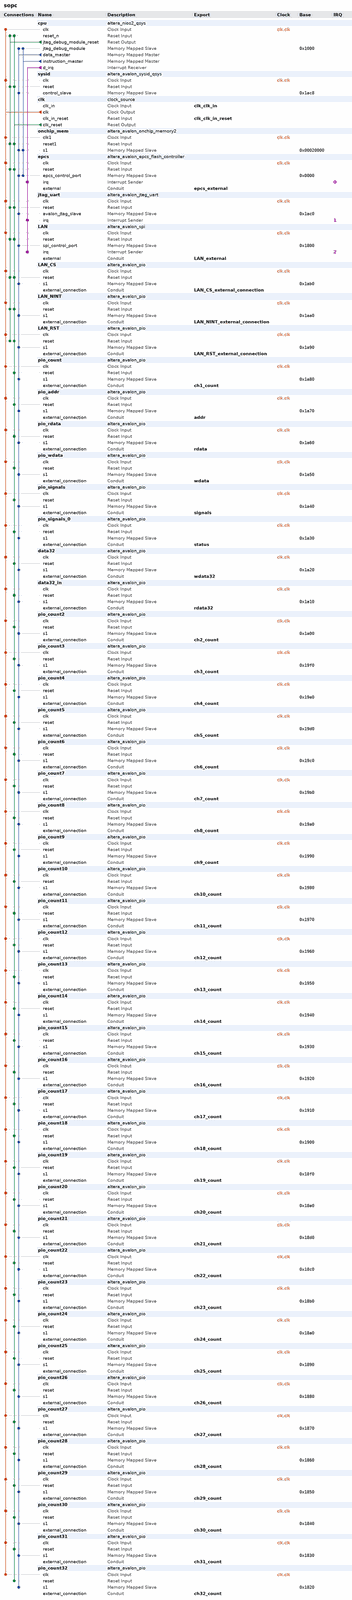
[diagram p0: system contents, whole]
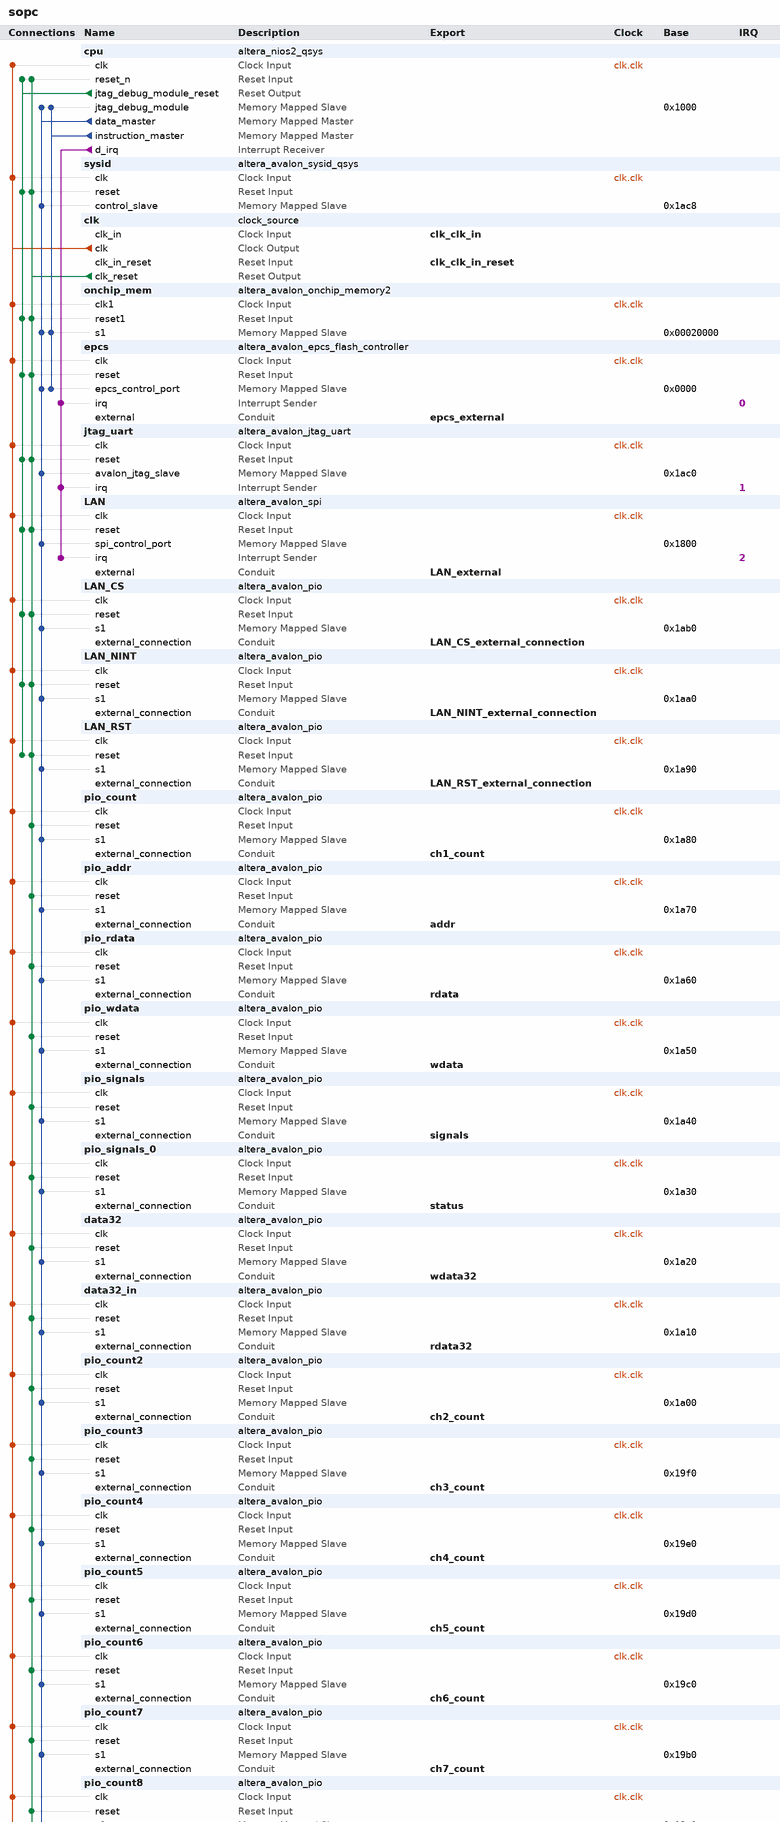
[diagram p1: system contents, upper part]
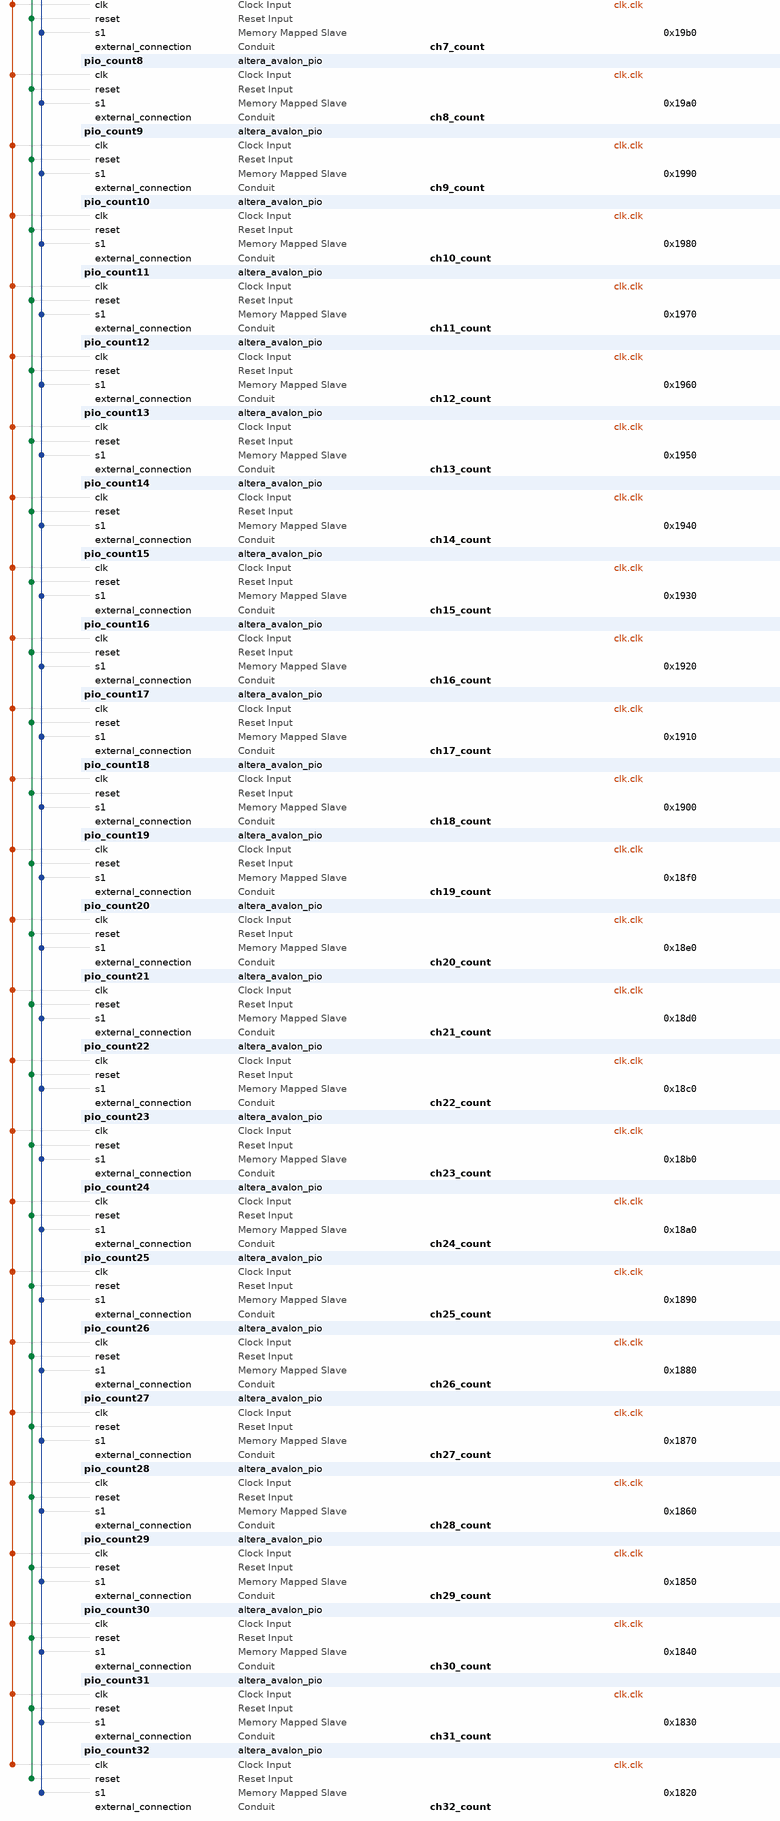
[diagram p2: system contents, lower part]
# Platform Designer (Qsys) system sopc, Cyclone IV GX Unknown
# Parameters at their usual value, and those the tool derives, are not listed.
package require -exact qsys 13.1
create_system sopc
set_project_property DEVICE_FAMILY {Cyclone IV GX}
set_project_property DEVICE Unknown

add_instance cpu altera_nios2_qsys 13.1
set_instance_parameter_value cpu manuallyAssignCpuID false
set_instance_parameter_value cpu resetSlave onchip_mem.s1
set_instance_parameter_value cpu exceptionSlave onchip_mem.s1
set_instance_parameter_value cpu breakSlave cpu.jtag_debug_module
set_instance_parameter_value cpu impl Tiny
set_instance_parameter_value cpu icache_size 2048
set_instance_parameter_value cpu dcache_size 0

add_instance sysid altera_avalon_sysid_qsys 13.1
set_instance_parameter_value sysid id 0

add_instance clk clock_source 13.1
set_instance_parameter_value clk clockFrequency 50000000

add_instance onchip_mem altera_avalon_onchip_memory2 13.1
set_instance_parameter_value onchip_mem dataWidth 32
set_instance_parameter_value onchip_mem dualPort false
set_instance_parameter_value onchip_mem initMemContent true
set_instance_parameter_value onchip_mem initializationFileName onchip_mem
set_instance_parameter_value onchip_mem memorySize 43000

add_instance epcs altera_avalon_epcs_flash_controller 13.1

add_instance jtag_uart altera_avalon_jtag_uart 13.1
set_instance_parameter_value jtag_uart simInteractiveOptions INTERACTIVE_ASCII_OUTPUT

add_instance LAN altera_avalon_spi 13.1
set_instance_parameter_value LAN clockPolarity 0
set_instance_parameter_value LAN dataWidth 8
set_instance_parameter_value LAN masterSPI true
set_instance_parameter_value LAN numberOfSlaves 1
set_instance_parameter_value LAN targetClockRate 500000

add_instance LAN_CS altera_avalon_pio 13.1
set_instance_parameter_value LAN_CS direction Output
set_instance_parameter_value LAN_CS width 1

add_instance LAN_NINT altera_avalon_pio 13.1
set_instance_parameter_value LAN_NINT direction Input
set_instance_parameter_value LAN_NINT width 1

add_instance LAN_RST altera_avalon_pio 13.1
set_instance_parameter_value LAN_RST direction Output
set_instance_parameter_value LAN_RST width 1

add_instance pio_count altera_avalon_pio 13.1
set_instance_parameter_value pio_count direction Input
set_instance_parameter_value pio_count width 32

add_instance pio_addr altera_avalon_pio 13.1
set_instance_parameter_value pio_addr direction Output
set_instance_parameter_value pio_addr width 8

add_instance pio_rdata altera_avalon_pio 13.1
set_instance_parameter_value pio_rdata direction Input
set_instance_parameter_value pio_rdata width 8

add_instance pio_wdata altera_avalon_pio 13.1
set_instance_parameter_value pio_wdata direction Output
set_instance_parameter_value pio_wdata width 8

add_instance pio_signals altera_avalon_pio 13.1
set_instance_parameter_value pio_signals direction Output
set_instance_parameter_value pio_signals width 8

add_instance pio_signals_0 altera_avalon_pio 13.1
set_instance_parameter_value pio_signals_0 direction Input
set_instance_parameter_value pio_signals_0 width 8

add_instance data32 altera_avalon_pio 13.1
set_instance_parameter_value data32 direction Output
set_instance_parameter_value data32 width 32

add_instance data32_in altera_avalon_pio 13.1
set_instance_parameter_value data32_in direction Output
set_instance_parameter_value data32_in width 32

add_instance pio_count2 altera_avalon_pio 13.1
set_instance_parameter_value pio_count2 direction Input
set_instance_parameter_value pio_count2 width 32

add_instance pio_count3 altera_avalon_pio 13.1
set_instance_parameter_value pio_count3 direction Input
set_instance_parameter_value pio_count3 width 32

add_instance pio_count4 altera_avalon_pio 13.1
set_instance_parameter_value pio_count4 direction Input
set_instance_parameter_value pio_count4 width 32

add_instance pio_count5 altera_avalon_pio 13.1
set_instance_parameter_value pio_count5 direction Input
set_instance_parameter_value pio_count5 width 32

add_instance pio_count6 altera_avalon_pio 13.1
set_instance_parameter_value pio_count6 direction Input
set_instance_parameter_value pio_count6 width 32

add_instance pio_count7 altera_avalon_pio 13.1
set_instance_parameter_value pio_count7 direction Input
set_instance_parameter_value pio_count7 width 32

add_instance pio_count8 altera_avalon_pio 13.1
set_instance_parameter_value pio_count8 direction Input
set_instance_parameter_value pio_count8 width 32

add_instance pio_count9 altera_avalon_pio 13.1
set_instance_parameter_value pio_count9 direction Input
set_instance_parameter_value pio_count9 width 32

add_instance pio_count10 altera_avalon_pio 13.1
set_instance_parameter_value pio_count10 direction Input
set_instance_parameter_value pio_count10 width 32

add_instance pio_count11 altera_avalon_pio 13.1
set_instance_parameter_value pio_count11 direction Input
set_instance_parameter_value pio_count11 width 32

add_instance pio_count12 altera_avalon_pio 13.1
set_instance_parameter_value pio_count12 direction Input
set_instance_parameter_value pio_count12 width 32

add_instance pio_count13 altera_avalon_pio 13.1
set_instance_parameter_value pio_count13 direction Input
set_instance_parameter_value pio_count13 width 32

add_instance pio_count14 altera_avalon_pio 13.1
set_instance_parameter_value pio_count14 direction Input
set_instance_parameter_value pio_count14 width 32

add_instance pio_count15 altera_avalon_pio 13.1
set_instance_parameter_value pio_count15 direction Input
set_instance_parameter_value pio_count15 width 32

add_instance pio_count16 altera_avalon_pio 13.1
set_instance_parameter_value pio_count16 direction Input
set_instance_parameter_value pio_count16 width 32

add_instance pio_count17 altera_avalon_pio 13.1
set_instance_parameter_value pio_count17 direction Input
set_instance_parameter_value pio_count17 width 32

add_instance pio_count18 altera_avalon_pio 13.1
set_instance_parameter_value pio_count18 direction Input
set_instance_parameter_value pio_count18 width 32

add_instance pio_count19 altera_avalon_pio 13.1
set_instance_parameter_value pio_count19 direction Input
set_instance_parameter_value pio_count19 width 32

add_instance pio_count20 altera_avalon_pio 13.1
set_instance_parameter_value pio_count20 direction Input
set_instance_parameter_value pio_count20 width 32

add_instance pio_count21 altera_avalon_pio 13.1
set_instance_parameter_value pio_count21 direction Input
set_instance_parameter_value pio_count21 width 32

add_instance pio_count22 altera_avalon_pio 13.1
set_instance_parameter_value pio_count22 direction Input
set_instance_parameter_value pio_count22 width 32

add_instance pio_count23 altera_avalon_pio 13.1
set_instance_parameter_value pio_count23 direction Input
set_instance_parameter_value pio_count23 width 32

add_instance pio_count24 altera_avalon_pio 13.1
set_instance_parameter_value pio_count24 direction Input
set_instance_parameter_value pio_count24 width 32

add_instance pio_count25 altera_avalon_pio 13.1
set_instance_parameter_value pio_count25 direction Input
set_instance_parameter_value pio_count25 width 32

add_instance pio_count26 altera_avalon_pio 13.1
set_instance_parameter_value pio_count26 direction Input
set_instance_parameter_value pio_count26 width 32

add_instance pio_count27 altera_avalon_pio 13.1
set_instance_parameter_value pio_count27 direction Input
set_instance_parameter_value pio_count27 width 32

add_instance pio_count28 altera_avalon_pio 13.1
set_instance_parameter_value pio_count28 direction Input
set_instance_parameter_value pio_count28 width 32

add_instance pio_count29 altera_avalon_pio 13.1
set_instance_parameter_value pio_count29 direction Input
set_instance_parameter_value pio_count29 width 32

add_instance pio_count30 altera_avalon_pio 13.1
set_instance_parameter_value pio_count30 direction Input
set_instance_parameter_value pio_count30 width 32

add_instance pio_count31 altera_avalon_pio 13.1
set_instance_parameter_value pio_count31 direction Input
set_instance_parameter_value pio_count31 width 32

add_instance pio_count32 altera_avalon_pio 13.1
set_instance_parameter_value pio_count32 direction Input
set_instance_parameter_value pio_count32 width 32

# connections
add_connection clk.clk cpu.clk clock
add_connection clk.clk data32.clk clock
add_connection clk.clk data32_in.clk clock
add_connection clk.clk epcs.clk clock
add_connection clk.clk jtag_uart.clk clock
add_connection clk.clk LAN.clk clock
add_connection clk.clk LAN_CS.clk clock
add_connection clk.clk LAN_NINT.clk clock
add_connection clk.clk LAN_RST.clk clock
add_connection clk.clk onchip_mem.clk1 clock
add_connection clk.clk pio_addr.clk clock
add_connection clk.clk pio_count2.clk clock
add_connection clk.clk pio_count3.clk clock
add_connection clk.clk pio_count4.clk clock
add_connection clk.clk pio_count5.clk clock
add_connection clk.clk pio_count6.clk clock
add_connection clk.clk pio_count7.clk clock
add_connection clk.clk pio_count8.clk clock
add_connection clk.clk pio_count9.clk clock
add_connection clk.clk pio_count10.clk clock
add_connection clk.clk pio_count11.clk clock
add_connection clk.clk pio_count12.clk clock
add_connection clk.clk pio_count13.clk clock
add_connection clk.clk pio_count14.clk clock
add_connection clk.clk pio_count15.clk clock
add_connection clk.clk pio_count16.clk clock
add_connection clk.clk pio_count17.clk clock
add_connection clk.clk pio_count18.clk clock
add_connection clk.clk pio_count19.clk clock
add_connection clk.clk pio_count20.clk clock
add_connection clk.clk pio_count21.clk clock
add_connection clk.clk pio_count22.clk clock
add_connection clk.clk pio_count23.clk clock
add_connection clk.clk pio_count24.clk clock
add_connection clk.clk pio_count25.clk clock
add_connection clk.clk pio_count26.clk clock
add_connection clk.clk pio_count27.clk clock
add_connection clk.clk pio_count28.clk clock
add_connection clk.clk pio_count29.clk clock
add_connection clk.clk pio_count30.clk clock
add_connection clk.clk pio_count31.clk clock
add_connection clk.clk pio_count32.clk clock
add_connection clk.clk pio_count.clk clock
add_connection clk.clk pio_rdata.clk clock
add_connection clk.clk pio_signals.clk clock
add_connection clk.clk pio_signals_0.clk clock
add_connection clk.clk pio_wdata.clk clock
add_connection clk.clk sysid.clk clock
add_connection clk.clk_reset cpu.reset_n reset
add_connection clk.clk_reset data32.reset reset
add_connection clk.clk_reset data32_in.reset reset
add_connection clk.clk_reset epcs.reset reset
add_connection clk.clk_reset jtag_uart.reset reset
add_connection clk.clk_reset LAN.reset reset
add_connection clk.clk_reset LAN_CS.reset reset
add_connection clk.clk_reset LAN_NINT.reset reset
add_connection clk.clk_reset LAN_RST.reset reset
add_connection clk.clk_reset onchip_mem.reset1 reset
add_connection clk.clk_reset pio_addr.reset reset
add_connection clk.clk_reset pio_count2.reset reset
add_connection clk.clk_reset pio_count3.reset reset
add_connection clk.clk_reset pio_count4.reset reset
add_connection clk.clk_reset pio_count5.reset reset
add_connection clk.clk_reset pio_count6.reset reset
add_connection clk.clk_reset pio_count7.reset reset
add_connection clk.clk_reset pio_count8.reset reset
add_connection clk.clk_reset pio_count9.reset reset
add_connection clk.clk_reset pio_count10.reset reset
add_connection clk.clk_reset pio_count11.reset reset
add_connection clk.clk_reset pio_count12.reset reset
add_connection clk.clk_reset pio_count13.reset reset
add_connection clk.clk_reset pio_count14.reset reset
add_connection clk.clk_reset pio_count15.reset reset
add_connection clk.clk_reset pio_count16.reset reset
add_connection clk.clk_reset pio_count17.reset reset
add_connection clk.clk_reset pio_count18.reset reset
add_connection clk.clk_reset pio_count19.reset reset
add_connection clk.clk_reset pio_count20.reset reset
add_connection clk.clk_reset pio_count21.reset reset
add_connection clk.clk_reset pio_count22.reset reset
add_connection clk.clk_reset pio_count23.reset reset
add_connection clk.clk_reset pio_count24.reset reset
add_connection clk.clk_reset pio_count25.reset reset
add_connection clk.clk_reset pio_count26.reset reset
add_connection clk.clk_reset pio_count27.reset reset
add_connection clk.clk_reset pio_count28.reset reset
add_connection clk.clk_reset pio_count29.reset reset
add_connection clk.clk_reset pio_count30.reset reset
add_connection clk.clk_reset pio_count31.reset reset
add_connection clk.clk_reset pio_count32.reset reset
add_connection clk.clk_reset pio_count.reset reset
add_connection clk.clk_reset pio_rdata.reset reset
add_connection clk.clk_reset pio_signals.reset reset
add_connection clk.clk_reset pio_signals_0.reset reset
add_connection clk.clk_reset pio_wdata.reset reset
add_connection clk.clk_reset sysid.reset reset
add_connection cpu.jtag_debug_module_reset cpu.reset_n reset
add_connection cpu.jtag_debug_module_reset epcs.reset reset
add_connection cpu.jtag_debug_module_reset jtag_uart.reset reset
add_connection cpu.jtag_debug_module_reset LAN.reset reset
add_connection cpu.jtag_debug_module_reset LAN_CS.reset reset
add_connection cpu.jtag_debug_module_reset LAN_NINT.reset reset
add_connection cpu.jtag_debug_module_reset LAN_RST.reset reset
add_connection cpu.jtag_debug_module_reset onchip_mem.reset1 reset
add_connection cpu.jtag_debug_module_reset sysid.reset reset
add_connection cpu.data_master cpu.jtag_debug_module avalon
set_connection_parameter_value cpu.data_master/cpu.jtag_debug_module baseAddress 0x1000
add_connection cpu.data_master data32.s1 avalon
set_connection_parameter_value cpu.data_master/data32.s1 baseAddress 0x1a20
add_connection cpu.data_master data32_in.s1 avalon
set_connection_parameter_value cpu.data_master/data32_in.s1 baseAddress 0x1a10
add_connection cpu.data_master epcs.epcs_control_port avalon
set_connection_parameter_value cpu.data_master/epcs.epcs_control_port baseAddress 0x0000
add_connection cpu.data_master jtag_uart.avalon_jtag_slave avalon
set_connection_parameter_value cpu.data_master/jtag_uart.avalon_jtag_slave baseAddress 0x1ac0
add_connection cpu.data_master LAN.spi_control_port avalon
set_connection_parameter_value cpu.data_master/LAN.spi_control_port baseAddress 0x1800
add_connection cpu.data_master LAN_CS.s1 avalon
set_connection_parameter_value cpu.data_master/LAN_CS.s1 baseAddress 0x1ab0
add_connection cpu.data_master LAN_NINT.s1 avalon
set_connection_parameter_value cpu.data_master/LAN_NINT.s1 baseAddress 0x1aa0
add_connection cpu.data_master LAN_RST.s1 avalon
set_connection_parameter_value cpu.data_master/LAN_RST.s1 baseAddress 0x1a90
add_connection cpu.data_master onchip_mem.s1 avalon
set_connection_parameter_value cpu.data_master/onchip_mem.s1 baseAddress 0x00020000
add_connection cpu.data_master pio_addr.s1 avalon
set_connection_parameter_value cpu.data_master/pio_addr.s1 baseAddress 0x1a70
add_connection cpu.data_master pio_count2.s1 avalon
set_connection_parameter_value cpu.data_master/pio_count2.s1 baseAddress 0x1a00
add_connection cpu.data_master pio_count3.s1 avalon
set_connection_parameter_value cpu.data_master/pio_count3.s1 baseAddress 0x19f0
add_connection cpu.data_master pio_count4.s1 avalon
set_connection_parameter_value cpu.data_master/pio_count4.s1 baseAddress 0x19e0
add_connection cpu.data_master pio_count5.s1 avalon
set_connection_parameter_value cpu.data_master/pio_count5.s1 baseAddress 0x19d0
add_connection cpu.data_master pio_count6.s1 avalon
set_connection_parameter_value cpu.data_master/pio_count6.s1 baseAddress 0x19c0
add_connection cpu.data_master pio_count7.s1 avalon
set_connection_parameter_value cpu.data_master/pio_count7.s1 baseAddress 0x19b0
add_connection cpu.data_master pio_count8.s1 avalon
set_connection_parameter_value cpu.data_master/pio_count8.s1 baseAddress 0x19a0
add_connection cpu.data_master pio_count9.s1 avalon
set_connection_parameter_value cpu.data_master/pio_count9.s1 baseAddress 0x1990
add_connection cpu.data_master pio_count10.s1 avalon
set_connection_parameter_value cpu.data_master/pio_count10.s1 baseAddress 0x1980
add_connection cpu.data_master pio_count11.s1 avalon
set_connection_parameter_value cpu.data_master/pio_count11.s1 baseAddress 0x1970
add_connection cpu.data_master pio_count12.s1 avalon
set_connection_parameter_value cpu.data_master/pio_count12.s1 baseAddress 0x1960
add_connection cpu.data_master pio_count13.s1 avalon
set_connection_parameter_value cpu.data_master/pio_count13.s1 baseAddress 0x1950
add_connection cpu.data_master pio_count14.s1 avalon
set_connection_parameter_value cpu.data_master/pio_count14.s1 baseAddress 0x1940
add_connection cpu.data_master pio_count15.s1 avalon
set_connection_parameter_value cpu.data_master/pio_count15.s1 baseAddress 0x1930
add_connection cpu.data_master pio_count16.s1 avalon
set_connection_parameter_value cpu.data_master/pio_count16.s1 baseAddress 0x1920
add_connection cpu.data_master pio_count17.s1 avalon
set_connection_parameter_value cpu.data_master/pio_count17.s1 baseAddress 0x1910
add_connection cpu.data_master pio_count18.s1 avalon
set_connection_parameter_value cpu.data_master/pio_count18.s1 baseAddress 0x1900
add_connection cpu.data_master pio_count19.s1 avalon
set_connection_parameter_value cpu.data_master/pio_count19.s1 baseAddress 0x18f0
add_connection cpu.data_master pio_count20.s1 avalon
set_connection_parameter_value cpu.data_master/pio_count20.s1 baseAddress 0x18e0
add_connection cpu.data_master pio_count21.s1 avalon
set_connection_parameter_value cpu.data_master/pio_count21.s1 baseAddress 0x18d0
add_connection cpu.data_master pio_count22.s1 avalon
set_connection_parameter_value cpu.data_master/pio_count22.s1 baseAddress 0x18c0
add_connection cpu.data_master pio_count23.s1 avalon
set_connection_parameter_value cpu.data_master/pio_count23.s1 baseAddress 0x18b0
add_connection cpu.data_master pio_count24.s1 avalon
set_connection_parameter_value cpu.data_master/pio_count24.s1 baseAddress 0x18a0
add_connection cpu.data_master pio_count25.s1 avalon
set_connection_parameter_value cpu.data_master/pio_count25.s1 baseAddress 0x1890
add_connection cpu.data_master pio_count26.s1 avalon
set_connection_parameter_value cpu.data_master/pio_count26.s1 baseAddress 0x1880
add_connection cpu.data_master pio_count27.s1 avalon
set_connection_parameter_value cpu.data_master/pio_count27.s1 baseAddress 0x1870
add_connection cpu.data_master pio_count28.s1 avalon
set_connection_parameter_value cpu.data_master/pio_count28.s1 baseAddress 0x1860
add_connection cpu.data_master pio_count29.s1 avalon
set_connection_parameter_value cpu.data_master/pio_count29.s1 baseAddress 0x1850
add_connection cpu.data_master pio_count30.s1 avalon
set_connection_parameter_value cpu.data_master/pio_count30.s1 baseAddress 0x1840
add_connection cpu.data_master pio_count31.s1 avalon
set_connection_parameter_value cpu.data_master/pio_count31.s1 baseAddress 0x1830
add_connection cpu.data_master pio_count32.s1 avalon
set_connection_parameter_value cpu.data_master/pio_count32.s1 baseAddress 0x1820
add_connection cpu.data_master pio_count.s1 avalon
set_connection_parameter_value cpu.data_master/pio_count.s1 baseAddress 0x1a80
add_connection cpu.data_master pio_rdata.s1 avalon
set_connection_parameter_value cpu.data_master/pio_rdata.s1 baseAddress 0x1a60
add_connection cpu.data_master pio_signals.s1 avalon
set_connection_parameter_value cpu.data_master/pio_signals.s1 baseAddress 0x1a40
add_connection cpu.data_master pio_signals_0.s1 avalon
set_connection_parameter_value cpu.data_master/pio_signals_0.s1 baseAddress 0x1a30
add_connection cpu.data_master pio_wdata.s1 avalon
set_connection_parameter_value cpu.data_master/pio_wdata.s1 baseAddress 0x1a50
add_connection cpu.data_master sysid.control_slave avalon
set_connection_parameter_value cpu.data_master/sysid.control_slave baseAddress 0x1ac8
add_connection cpu.instruction_master cpu.jtag_debug_module avalon
set_connection_parameter_value cpu.instruction_master/cpu.jtag_debug_module baseAddress 0x1000
add_connection cpu.instruction_master epcs.epcs_control_port avalon
set_connection_parameter_value cpu.instruction_master/epcs.epcs_control_port baseAddress 0x0000
add_connection cpu.instruction_master onchip_mem.s1 avalon
set_connection_parameter_value cpu.instruction_master/onchip_mem.s1 baseAddress 0x00020000
add_connection cpu.d_irq epcs.irq interrupt
set_connection_parameter_value cpu.d_irq/epcs.irq irqNumber 0
add_connection cpu.d_irq jtag_uart.irq interrupt
set_connection_parameter_value cpu.d_irq/jtag_uart.irq irqNumber 1
add_connection cpu.d_irq LAN.irq interrupt
set_connection_parameter_value cpu.d_irq/LAN.irq irqNumber 2

# exported interfaces
add_interface clk_clk_in_reset reset sink
set_interface_property clk_clk_in_reset EXPORT_OF clk.clk_in_reset
add_interface LAN_RST_external_connection conduit end
set_interface_property LAN_RST_external_connection EXPORT_OF LAN_RST.external_connection
add_interface LAN_CS_external_connection conduit end
set_interface_property LAN_CS_external_connection EXPORT_OF LAN_CS.external_connection
add_interface LAN_external conduit end
set_interface_property LAN_external EXPORT_OF LAN.external
add_interface clk_clk_in clock sink
set_interface_property clk_clk_in EXPORT_OF clk.clk_in
add_interface LAN_NINT_external_connection conduit end
set_interface_property LAN_NINT_external_connection EXPORT_OF LAN_NINT.external_connection
add_interface epcs_external conduit end
set_interface_property epcs_external EXPORT_OF epcs.external
add_interface ch1_count conduit end
set_interface_property ch1_count EXPORT_OF pio_count.external_connection
add_interface addr conduit end
set_interface_property addr EXPORT_OF pio_addr.external_connection
add_interface rdata conduit end
set_interface_property rdata EXPORT_OF pio_rdata.external_connection
add_interface wdata conduit end
set_interface_property wdata EXPORT_OF pio_wdata.external_connection
add_interface signals conduit end
set_interface_property signals EXPORT_OF pio_signals.external_connection
add_interface status conduit end
set_interface_property status EXPORT_OF pio_signals_0.external_connection
add_interface wdata32 conduit end
set_interface_property wdata32 EXPORT_OF data32.external_connection
add_interface rdata32 conduit end
set_interface_property rdata32 EXPORT_OF data32_in.external_connection
add_interface ch2_count conduit end
set_interface_property ch2_count EXPORT_OF pio_count2.external_connection
add_interface ch3_count conduit end
set_interface_property ch3_count EXPORT_OF pio_count3.external_connection
add_interface ch4_count conduit end
set_interface_property ch4_count EXPORT_OF pio_count4.external_connection
add_interface ch5_count conduit end
set_interface_property ch5_count EXPORT_OF pio_count5.external_connection
add_interface ch6_count conduit end
set_interface_property ch6_count EXPORT_OF pio_count6.external_connection
add_interface ch7_count conduit end
set_interface_property ch7_count EXPORT_OF pio_count7.external_connection
add_interface ch8_count conduit end
set_interface_property ch8_count EXPORT_OF pio_count8.external_connection
add_interface ch9_count conduit end
set_interface_property ch9_count EXPORT_OF pio_count9.external_connection
add_interface ch10_count conduit end
set_interface_property ch10_count EXPORT_OF pio_count10.external_connection
add_interface ch11_count conduit end
set_interface_property ch11_count EXPORT_OF pio_count11.external_connection
add_interface ch12_count conduit end
set_interface_property ch12_count EXPORT_OF pio_count12.external_connection
add_interface ch13_count conduit end
set_interface_property ch13_count EXPORT_OF pio_count13.external_connection
add_interface ch14_count conduit end
set_interface_property ch14_count EXPORT_OF pio_count14.external_connection
add_interface ch15_count conduit end
set_interface_property ch15_count EXPORT_OF pio_count15.external_connection
add_interface ch16_count conduit end
set_interface_property ch16_count EXPORT_OF pio_count16.external_connection
add_interface ch17_count conduit end
set_interface_property ch17_count EXPORT_OF pio_count17.external_connection
add_interface ch18_count conduit end
set_interface_property ch18_count EXPORT_OF pio_count18.external_connection
add_interface ch19_count conduit end
set_interface_property ch19_count EXPORT_OF pio_count19.external_connection
add_interface ch20_count conduit end
set_interface_property ch20_count EXPORT_OF pio_count20.external_connection
add_interface ch21_count conduit end
set_interface_property ch21_count EXPORT_OF pio_count21.external_connection
add_interface ch22_count conduit end
set_interface_property ch22_count EXPORT_OF pio_count22.external_connection
add_interface ch23_count conduit end
set_interface_property ch23_count EXPORT_OF pio_count23.external_connection
add_interface ch24_count conduit end
set_interface_property ch24_count EXPORT_OF pio_count24.external_connection
add_interface ch25_count conduit end
set_interface_property ch25_count EXPORT_OF pio_count25.external_connection
add_interface ch26_count conduit end
set_interface_property ch26_count EXPORT_OF pio_count26.external_connection
add_interface ch27_count conduit end
set_interface_property ch27_count EXPORT_OF pio_count27.external_connection
add_interface ch28_count conduit end
set_interface_property ch28_count EXPORT_OF pio_count28.external_connection
add_interface ch29_count conduit end
set_interface_property ch29_count EXPORT_OF pio_count29.external_connection
add_interface ch30_count conduit end
set_interface_property ch30_count EXPORT_OF pio_count30.external_connection
add_interface ch31_count conduit end
set_interface_property ch31_count EXPORT_OF pio_count31.external_connection
add_interface ch32_count conduit end
set_interface_property ch32_count EXPORT_OF pio_count32.external_connection

set_interconnect_requirement {$system} qsys_mm.clockCrossingAdapter HANDSHAKE
set_interconnect_requirement {$system} qsys_mm.maxAdditionalLatency 0

save_system sopc.qsys
